# Altium schematic sheet FPGA.SCHDOC
size B
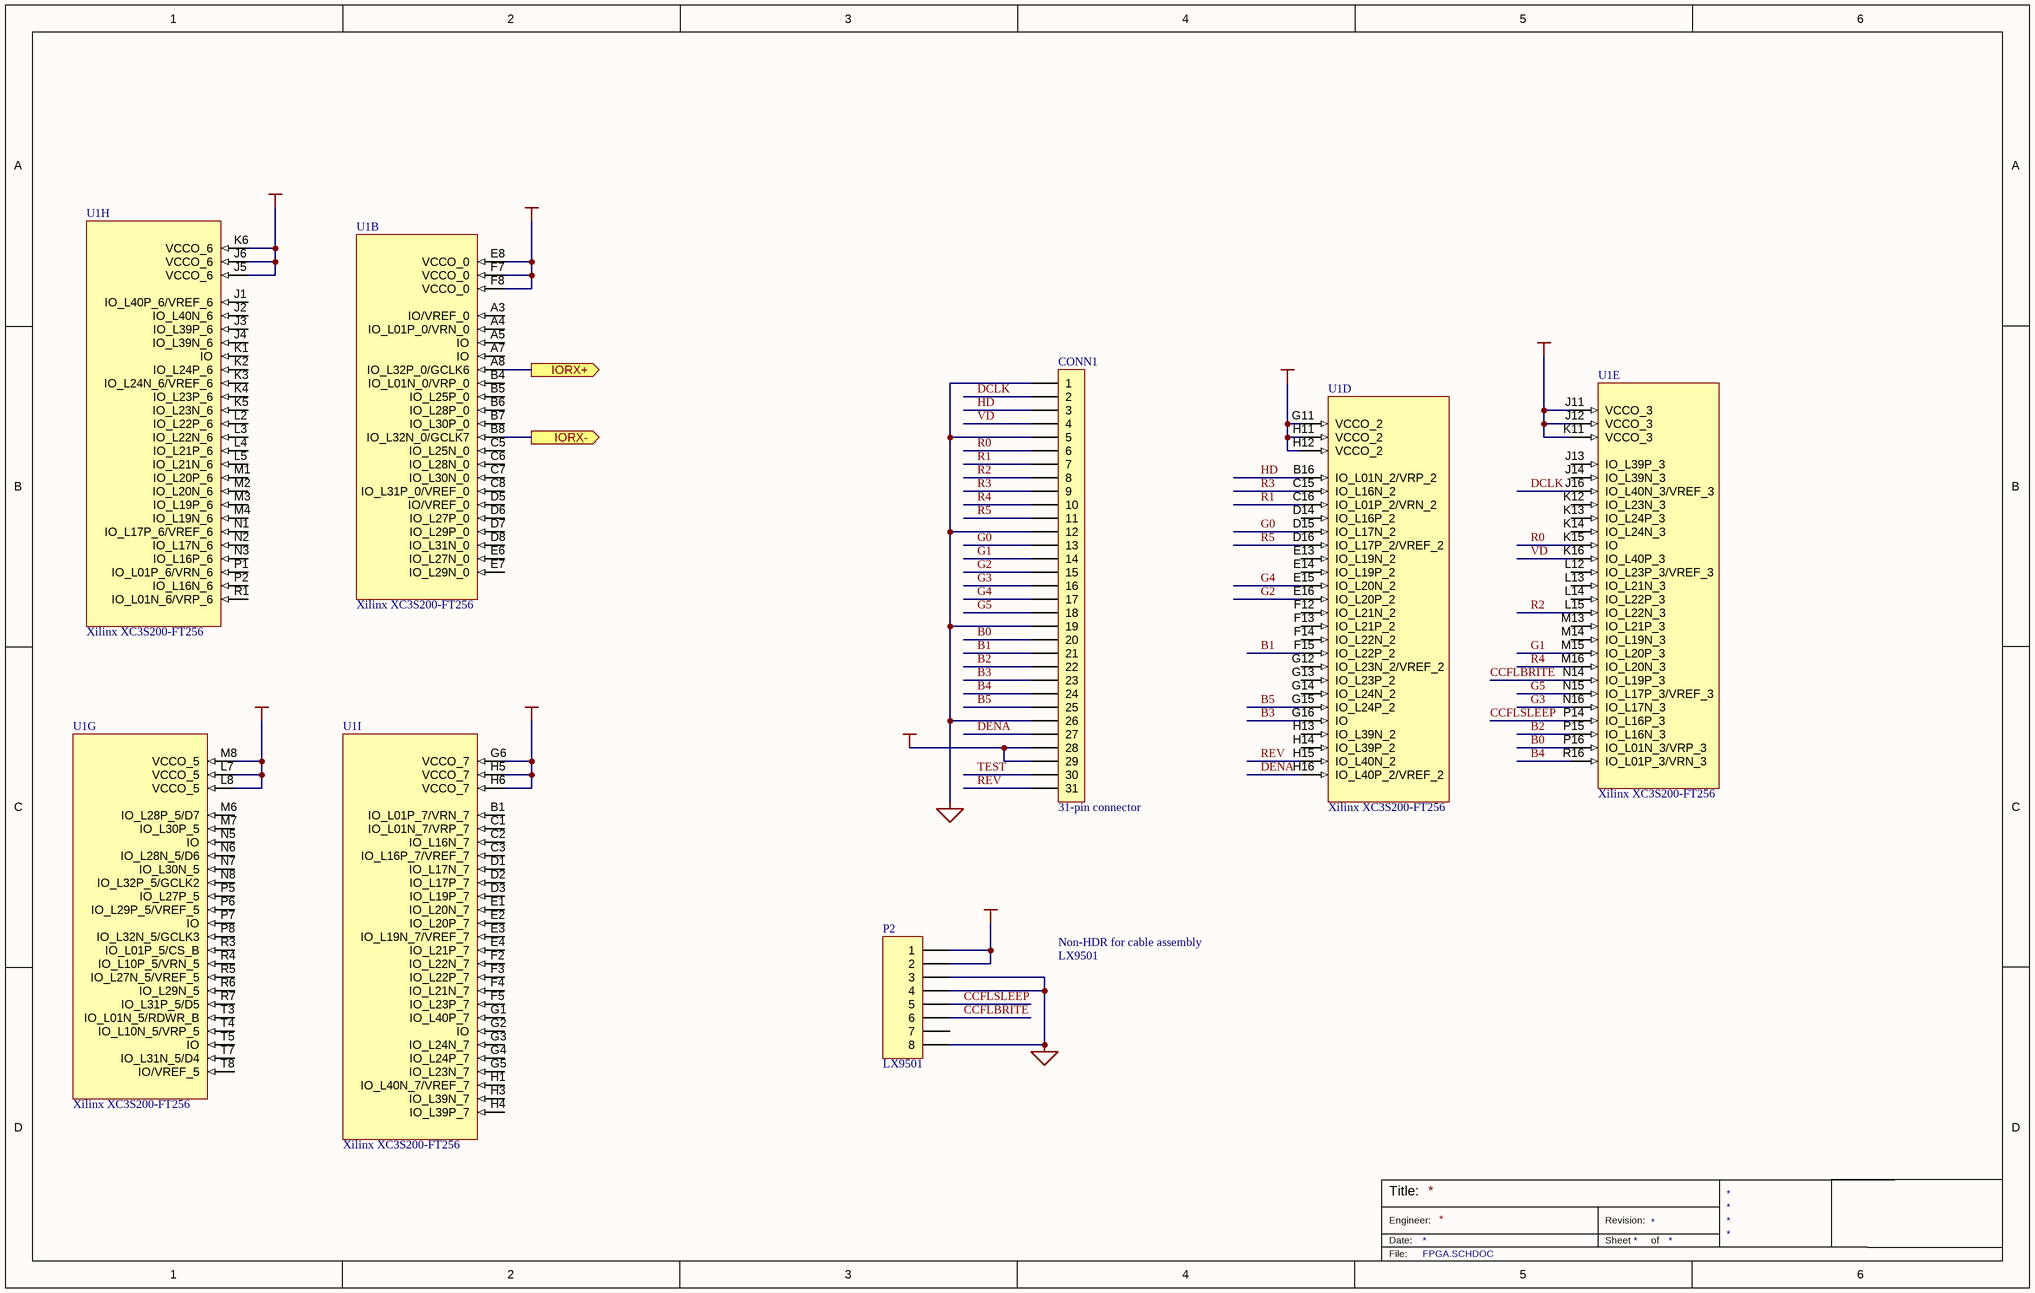
[diagram p0: FPGA.SCHDOC]

## Parts
CONN1  31-pin connector  [DF9A-31S-1V]
P2  LX9501  [HDR1X8]
U1  Xilinx XC3S200-FT256  [Xilinx FT256 BGA]  (parts B,D,E,G,H,I of 9)

## Ports
IORX+ (out), IORX- (out)

## Nets
+2.5VCC: U1.E8(VCCO_0) U1.F7(VCCO_0) U1.F8(VCCO_0)
+12VCC: P2.1 P2.2
GND: CONN1.1 CONN1.5 CONN1.12 CONN1.19 CONN1.26 P2.3 P2.4 P2.8
VCC: CONN1.28 CONN1.29 U1.G6(VCCO_7) U1.G11(VCCO_2) U1.H5(VCCO_7) U1.H6(VCCO_7) U1.H11(VCCO_2) U1.H12(VCCO_2) U1.J5(VCCO_6) U1.J6(VCCO_6) U1.J11(VCCO_3) U1.J12(VCCO_3) U1.K6(VCCO_6) U1.K11(VCCO_3) U1.L7(VCCO_5) U1.L8(VCCO_5) U1.M8(VCCO_5)
B0: CONN1.20 U1.P16(IO_L01N_3/VRP_3)
B1: CONN1.21 U1.F15(IO_L22P_2)
B2: CONN1.22 U1.P15(IO_L16N_3)
B3: CONN1.23 U1.G16(IO)
B4: CONN1.24 U1.R16(IO_L01P_3/VRN_3)
B5: CONN1.25 U1.G15(IO_L24P_2)
CCFLBRITE: P2.6 U1.N14(IO_L19P_3)
CCFLSLEEP: P2.5 U1.P14(IO_L16P_3)
DCLK: CONN1.2 U1.J16(IO_L40N_3/VREF_3)
DENA: CONN1.27 U1.H16(IO_L40P_2/VREF_2)
G0: CONN1.13 U1.D15(IO_L17N_2)
G1: CONN1.14 U1.M15(IO_L20P_3)
G2: CONN1.15 U1.E16(IO_L20P_2)
G3: CONN1.16 U1.N16(IO_L17N_3)
G4: CONN1.17 U1.E15(IO_L20N_2)
G5: CONN1.18 U1.N15(IO_L17P_3/VREF_3)
HD: CONN1.3 U1.B16(IO_L01N_2/VRP_2)
IORX+: U1.A8(IO_L32P_0/GCLK6) ; port IORX+
IORX-: U1.B8(IO_L32N_0/GCLK7) ; port IORX-
R0: CONN1.6 U1.K15(IO)
R1: CONN1.7 U1.C16(IO_L01P_2/VRN_2)
R2: CONN1.8 U1.L15(IO_L22N_3)
R3: CONN1.9 U1.C15(IO_L16N_2)
R4: CONN1.10 U1.M16(IO_L20N_3)
R5: CONN1.11 U1.D16(IO_L17P_2/VREF_2)
REV: CONN1.31 U1.H15(IO_L40N_2)
TEST: CONN1.30
VD: CONN1.4 U1.K16(IO_L40P_3)

Not connected (* = marked no-connect by the designer): P2 7; U1 A3(IO/VREF_0) A4(IO_L01P_0/VRN_0) A5(IO) A7(IO) B1(IO_L01P_7/VRN_7) B4(IO_L01N_0/VRP_0) B5(IO_L25P_0) B6(IO_L28P_0) B7(IO_L30P_0) C1(IO_L01N_7/VRP_7) C2(IO_L16N_7) C3(IO_L16P_7/VREF_7) C5(IO_L25N_0) C6(IO_L28N_0) C7(IO_L30N_0) C8(IO_L31P_0/VREF_0) D1(IO_L17N_7) D2(IO_L17P_7) D3(IO_L19P_7) D5(IO/VREF_0) D6(IO_L27P_0) D7(IO_L29P_0) D8(IO_L31N_0) D14(IO_L16P_2) E1(IO_L20N_7) E2(IO_L20P_7) E3(IO_L19N_7/VREF_7) E4(IO_L21P_7) E6(IO_L27N_0) E7(IO_L29N_0) E13(IO_L19N_2) E14(IO_L19P_2) F2(IO_L22N_7) F3(IO_L22P_7) F4(IO_L21N_7) F5(IO_L23P_7) F12(IO_L21N_2) F13(IO_L21P_2) F14(IO_L22N_2) G1(IO_L40P_7) G2(IO) G3(IO_L24N_7) G4(IO_L24P_7) G5(IO_L23N_7) G12(IO_L23N_2/VREF_2) G13(IO_L23P_2) G14(IO_L24N_2) H1(IO_L40N_7/VREF_7) H3(IO_L39N_7) H4(IO_L39P_7) H13(IO_L39N_2) H14(IO_L39P_2) J1(IO_L40P_6/VREF_6) J2(IO_L40N_6) J3(IO_L39P_6) J4(IO_L39N_6) J13(IO_L39P_3) J14(IO_L39N_3) K1(IO) K2(IO_L24P_6) K3(IO_L24N_6/VREF_6) K4(IO_L23P_6) K5(IO_L23N_6) K12(IO_L23N_3) K13(IO_L24P_3) K14(IO_L24N_3) L2(IO_L22P_6) L3(IO_L22N_6) L4(IO_L21P_6) L5(IO_L21N_6) L12(IO_L23P_3/VREF_3) L13(IO_L21N_3) L14(IO_L22P_3) M1(IO_L20P_6) M2(IO_L20N_6) M3(IO_L19P_6) M4(IO_L19N_6) M6(IO_L28P_5/D7) M7(IO_L30P_5) M13(IO_L21P_3) M14(IO_L19N_3) N1(IO_L17P_6/VREF_6) N2(IO_L17N_6) N3(IO_L16P_6) N5(IO) N6(IO_L28N_5/D6) N7(IO_L30N_5) N8(IO_L32P_5/GCLK2) P1(IO_L01P_6/VRN_6) P2(IO_L16N_6) P5(IO_L27P_5) P6(IO_L29P_5/VREF_5) P7(IO) P8(IO_L32N_5/GCLK3) R1(IO_L01N_6/VRP_6) R3(IO_L01P_5/CS_B) R4(IO_L10P_5/VRN_5) R5(IO_L27N_5/VREF_5) R6(IO_L29N_5) R7(IO_L31P_5/D5) T3(IO_L01N_5/RDWR_B) T4(IO_L10N_5/VRP_5) T5(IO) T7(IO_L31N_5/D4) T8(IO/VREF_5)

## Notes on the sheet
- Non-HDR for cable assembly
- LX9501
- Title:
- Engineer:
- Date:
- Revision:
- Sheet
- of
- File:

## Library data of the parts
CONN1 = CON31
P2 = Header 8: Header, 8-Pin; LatestRevisionDate: 17-Jul-2002; LatestRevisionNote: Re-released for DXP Platform.; Publisher: Altium Limited
U1 = XC3S200-FT256: Xilinx Spartan-3 FPGA